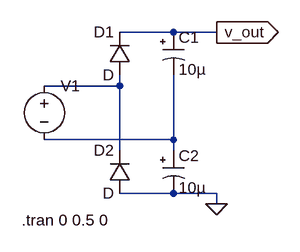
[diagram p0: schematic voltage_doubler_symetrical.asc]
voltage_doubler_symetrical.asc, the LTspice schematic file:
Version 4
SHEET 1 880 680
WIRE 304 48 224 48
WIRE 368 48 304 48
WIRE 224 128 224 112
WIRE 224 128 112 128
WIRE 304 208 304 112
WIRE 304 208 112 208
WIRE 224 224 224 128
WIRE 304 224 304 208
WIRE 304 288 224 288
WIRE 368 288 304 288
WIRE 368 304 368 288
FLAG 368 304 0
FLAG 368 48 v_out
IOPIN 368 48 Out
SYMBOL voltage 112 112 R0
WINDOW 3 24 96 Invisible 2
WINDOW 123 0 0 Left 0
WINDOW 39 0 0 Left 0
SYMATTR InstName V1
SYMATTR Value SINE(0 155.56 60)
SYMBOL diode 240 112 R180
WINDOW 0 24 64 Left 2
WINDOW 3 24 0 Left 2
SYMATTR InstName D1
SYMBOL diode 240 288 R180
WINDOW 0 24 64 Left 2
WINDOW 3 24 0 Left 2
SYMATTR InstName D2
SYMBOL polcap 288 48 R0
SYMATTR InstName C1
SYMATTR Value 10µ
SYMBOL polcap 288 224 R0
SYMATTR InstName C2
SYMATTR Value 10µ
TEXT 78 328 Left 2 !.tran 0 0.5 0

The netlist it stands for:
* voltage_doubler_symetrical.asc
V1 N001 N002 SINE(0 155.56 60)
D1 N001 v_out D
D2 0 N001 D
C1 v_out N002 10µ
C2 N002 0 10µ
.model D D
.lib standard.dio
.tran 0 0.5 0
.backanno
.end